# Altium schematic sheet RK3566_HDMI_GPIO.SchDoc
size A3; SheetNumber: 12; SheetTotal: 14
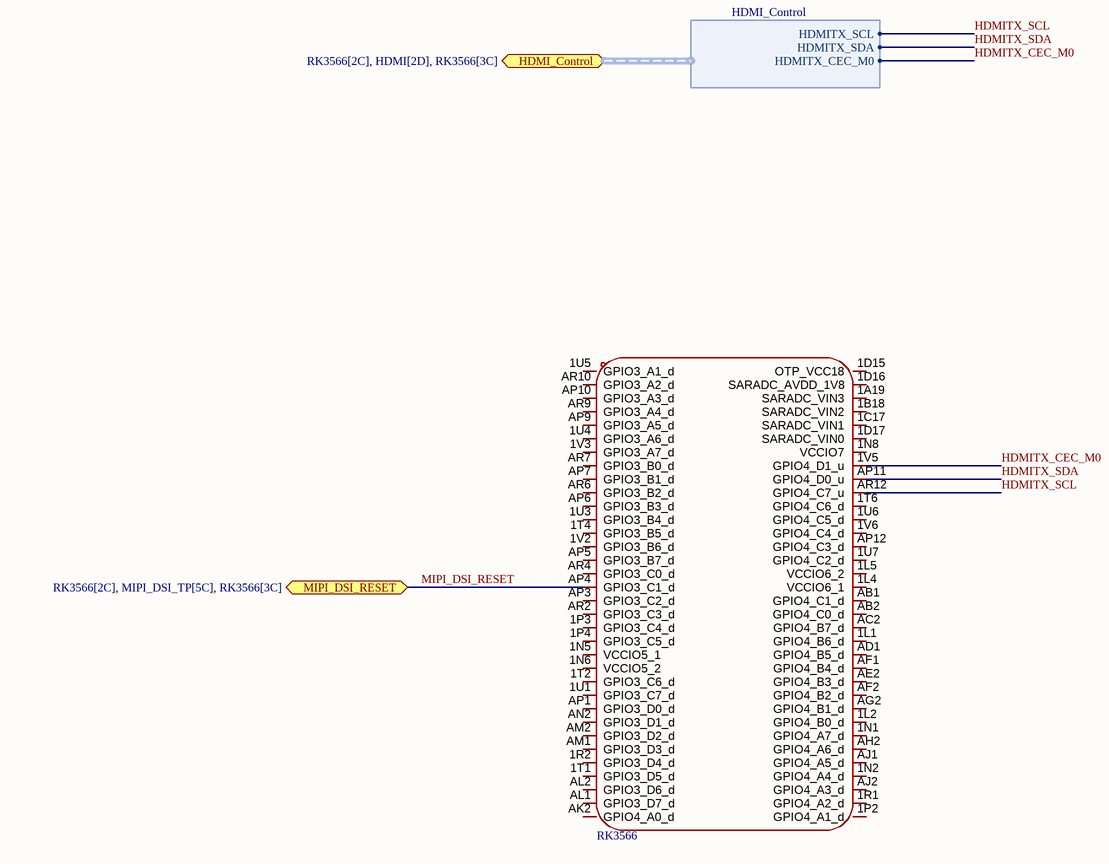
[diagram p0: RK3566_HDMI_GPIO.SchDoc]

## Parts
U1  RK3566  [BGA-565_L15.5-W14.4-P0.40_RK3566_1]  (part F of 8)

## Ports
HDMI_Control (bidir, harness HDMI_Control, see RK3566[2C], HDMI[2D], RK3566[3C]), MIPI_DSI_RESET (bidir, see RK3566[2C], MIPI_DSI_TP[5C], RK3566[3C])

## Harnesses
HDMI_Control: HDMITX_SCL, HDMITX_SDA, HDMITX_CEC_M0

## Nets
HDMITX_CEC_M0: U1.1V5(GPIO4_D1_u) ; port HDMI_Control.HDMITX_CEC_M0
HDMITX_SCL: U1.AR12(GPIO4_C7_u) ; port HDMI_Control.HDMITX_SCL
HDMITX_SDA: U1.AP11(GPIO4_D0_u) ; port HDMI_Control.HDMITX_SDA
MIPI_DSI_RESET: U1.AP4(GPIO3_C1_d) ; port MIPI_DSI_RESET

Not connected (* = marked no-connect by the designer): U1 1A19(SARADC_VIN3) 1B18(SARADC_VIN2) 1C17(SARADC_VIN1) 1D15(OTP_VCC18) 1D16(SARADC_AVDD_1V8) 1D17(SARADC_VIN0) 1L1(GPIO4_B6_d) 1L2(GPIO4_B0_d) 1L4(VCCIO6_1) 1L5(VCCIO6_2) 1N1(GPIO4_A7_d) 1N2(GPIO4_A4_d) 1N5(VCCIO5_1) 1N6(VCCIO5_2) 1N8(VCCIO7) 1P2(GPIO4_A1_d) 1P3(GPIO3_C4_d) 1P4(GPIO3_C5_d) 1R1(GPIO4_A2_d) 1R2(GPIO3_D4_d) 1T1(GPIO3_D5_d) 1T2(GPIO3_C6_d) 1T4(GPIO3_B5_d) 1T6(GPIO4_C6_d) 1U1(GPIO3_C7_d) 1U3(GPIO3_B4_d) 1U4(GPIO3_A6_d) 1U5(GPIO3_A1_d) 1U6(GPIO4_C5_d) 1U7(GPIO4_C2_d) 1V2(GPIO3_B6_d) 1V3(GPIO3_A7_d) 1V6(GPIO4_C4_d) AB1(GPIO4_C1_d) AB2(GPIO4_C0_d) AC2(GPIO4_B7_d) AD1(GPIO4_B5_d) AE2(GPIO4_B3_d) AF1(GPIO4_B4_d) AF2(GPIO4_B2_d) AG2(GPIO4_B1_d) AH2(GPIO4_A6_d) AJ1(GPIO4_A5_d) AJ2(GPIO4_A3_d) AK2(GPIO4_A0_d) AL1(GPIO3_D7_d) AL2(GPIO3_D6_d) AM1(GPIO3_D3_d) AM2(GPIO3_D2_d) AN2(GPIO3_D1_d) AP1(GPIO3_D0_d) AP3(GPIO3_C2_d) AP5(GPIO3_B7_d) AP6(GPIO3_B3_d) AP7(GPIO3_B1_d) AP9(GPIO3_A5_d) AP10(GPIO3_A3_d) AP12(GPIO4_C3_d) AR2(GPIO3_C3_d) AR4(GPIO3_C0_d) AR6(GPIO3_B2_d) AR7(GPIO3_B0_d) AR9(GPIO3_A4_d) AR10(GPIO3_A2_d)

## Library data of the parts
U1 = RK3566: BGA-565(15.5x14.4); Symbol: RK3566